# EAGLE design e-Tapperhandpiece30 (EAGLE 8.4.1)
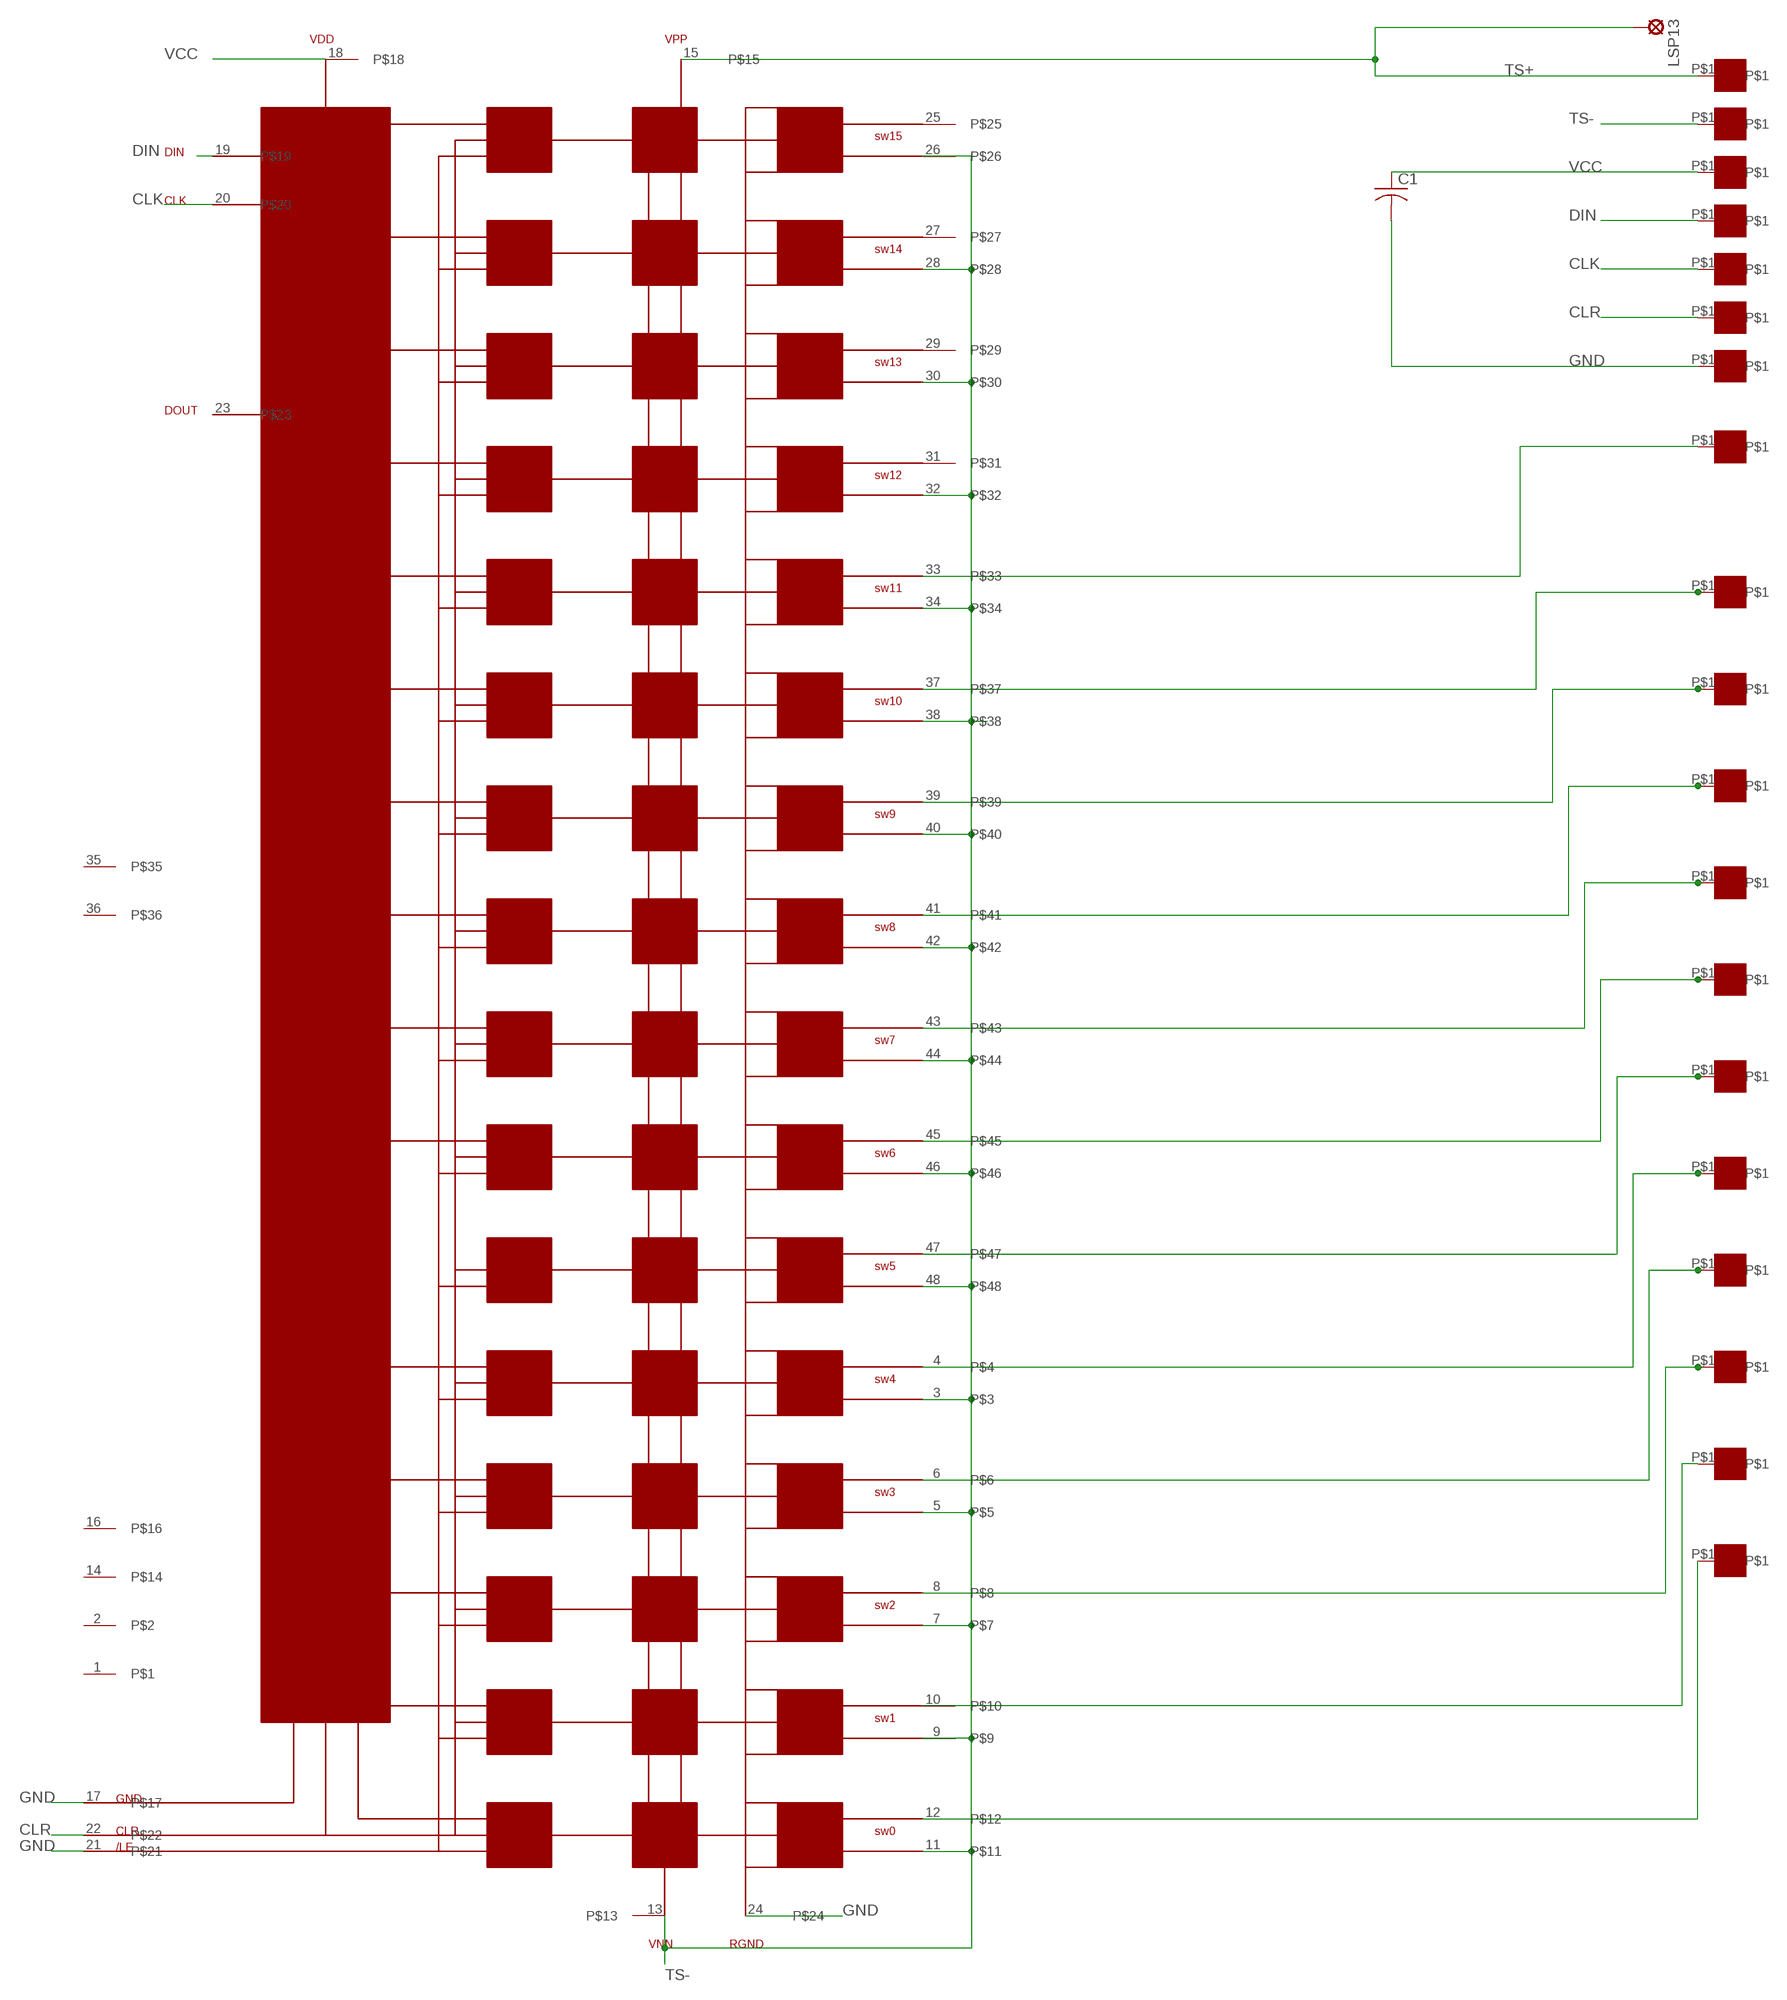
[diagram p0: schematic, sheet 1]

## Parts
C1  C-USC0805  [C0805]
LSP13  SE11  [SE11]
TSP1  ET1  [ET1]
TSP2  ET1  [ET1]
TSP3  ET1  [ET1]
TSP4  ET1  [ET1]
TSP5  ET1  [ET1]
TSP6  ET1  [ET1]
TSP7  ET1  [ET1]
TSP8  ET1  [ET1]
TSP9  ET1  [ET1]
TSP10  ET1  [ET1]
TSP11  ET1  [ET1]
TSP12  ET1  [ET1]
TSP13  ET1  [ET1]
TSP14  ET1  [ET1]
TSP15  ET1  [ET1]
TSP16  ET1  [ET1]
TSP17  ET1  [ET1]
TSP18  ET1  [ET1]
TSP19  ET1  [ET1]
U$1  CPC7701  [LQFP48]

## Nets
CLK: TSP17.P$1 U$1.20
CLR: TSP18.P$1 U$1.22
DIN: TSP16.P$1 U$1.19
GND: C1.2 TSP19.P$1 U$1.17 U$1.21 U$1.24
N$4: TSP1.P$1 U$1.33
N$6: TSP2.P$1 U$1.37
N$10: TSP3.P$1 U$1.39
N$11: TSP4.P$1 U$1.41
N$12: TSP5.P$1 U$1.43
N$13: TSP6.P$1 U$1.45
N$14: TSP7.P$1 U$1.47
N$15: TSP8.P$1 U$1.4
N$16: TSP9.P$1 U$1.6
N$17: TSP10.P$1 U$1.8
N$21: TSP11.P$1 U$1.10
N$26: TSP12.P$1 U$1.12
TS+: LSP13.MP TSP13.P$1 U$1.15
TS-: TSP14.P$1 U$1.3 U$1.5 U$1.7 U$1.9 U$1.11 U$1.13 U$1.26 U$1.28 U$1.30 U$1.32 U$1.34 U$1.38 U$1.40 U$1.42 U$1.44 U$1.46 U$1.48
VCC: C1.1 TSP15.P$1 U$1.18
Unconnected: U$1.1 U$1.2 U$1.14 U$1.16 U$1.23 U$1.25 U$1.27 U$1.29 U$1.31 U$1.35 U$1.36

## Library data of the parts
C1 = resistor:C-US: CAPACITOR, American symbol
LSP13 = solpad:SE11: SOLDER PAD RTM, drill 1,1mm, distributor Buerklin, 07F810
TSP1-TSP19 = ET1:ET1: Through Hold Pads 20 mil drill hole
U$1 = CPC7701:CPC7701: High Voltage cmos 16 channel analog switch in 48 plcc package 3.3V logic level 200V switch

## Net classes
0 default: clearance 0.205 mm

## Board
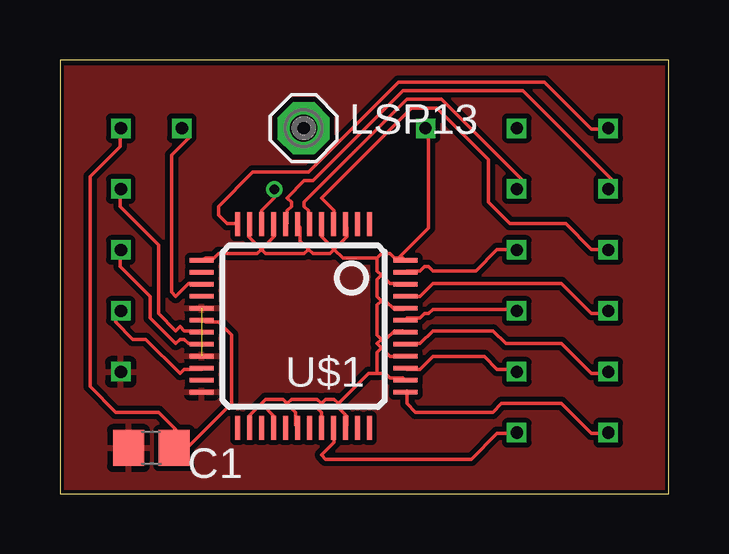
[diagram p1: board, top side]
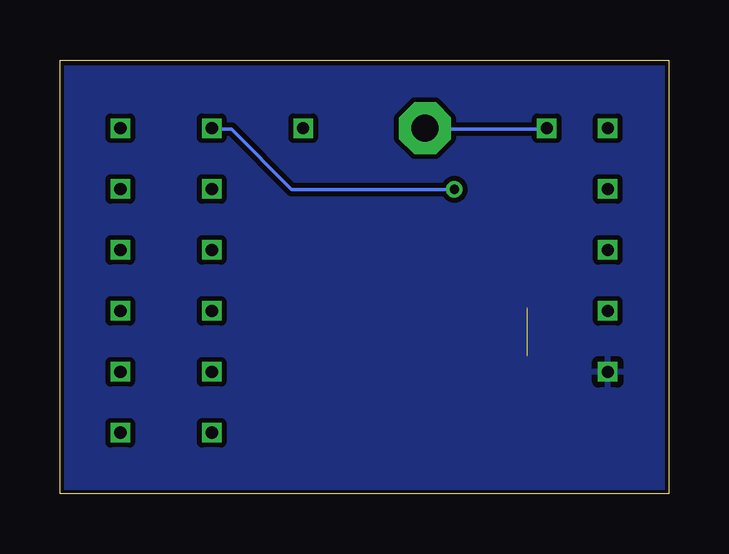
[diagram p2: board, bottom side, seen from below]

Size 25.38 x 18.09 mm. Coordinates in mm from the lower left corner, seen from the top.
Outline: 0,0 25.38,0 25.38,18.09 0,18.09 0,0
Copper layers (1*16): Top 0.035mm / dielectric 1.5mm / Bottom 0.035mm
Design rules "e-tapperhandpiece14 *": minimum track width 6mil, minimum drill 15mil, track to track 6mil, track to pad 6mil, pad to pad 6mil, via to via 6mil, smd to smd 6mil, copper to edge 6mil, drill to drill 6mil, minimum pad ring 6mil, minimum via ring 6mil, stop-mask expansion 4mil, vias tented up to drill 0mil, thermal gap 10mil

### Footprints (pad centres in the part's own frame; a part is rotated, then mirrored left to right if it is on the bottom)
C0805 = smd 1.3 x 1.5: 1 -0.95,0; 2 0.95,0
SE11 = drill 1.118 pad 2.159 octagon: MP 0,0
ET1 = drill 0.508 square: P$1 0,0
LQFP48 = smd 0.2 x 1: 1 -2.75,-4.25; 2 -2.25,-4.25; 3 -1.75,-4.25; 4 -1.25,-4.25; 5 -0.75,-4.25; 6 -0.25,-4.25; 7 0.25,-4.25; 8 0.75,-4.25; 9 1.25,-4.25; 10 1.75,-4.25; 11 2.25,-4.25; 12 2.75,-4.25; 25 2.75,4.25; 26 2.25,4.25; 27 1.75,4.25; 28 1.25,4.25; 29 0.75,4.25; 30 0.25,4.25; 31 -0.25,4.25; 32 -0.75,4.25; 33 -1.25,4.25; 34 -1.75,4.25; 35 -2.25,4.25; 36 -2.75,4.25 | smd 1 x 0.2: 13 4.25,-2.75; 14 4.25,-2.25; 15 4.25,-1.75; 16 4.25,-1.25; 17 4.25,-0.75; 18 4.25,-0.25; 19 4.25,0.25; 20 4.25,0.75; 21 4.25,1.25; 22 4.25,1.75; 23 4.25,2.25; 24 4.25,2.75; 37 -4.25,2.75; 38 -4.25,2.25; 39 -4.25,1.75; 40 -4.25,1.25; 41 -4.25,0.75; 42 -4.25,0.25; 43 -4.25,-0.25; 44 -4.25,-0.75; 45 -4.25,-1.25; 46 -4.25,-1.75; 47 -4.25,-2.25; 48 -4.25,-2.75

### Placement (x,y rotation side)
C1  3.81,1.91 180 top
LSP13  10.16,15.24 0 top
TSP1  19.05,2.54 0 top
TSP2  22.86,2.54 0 top
TSP3  19.05,5.08 0 top
TSP4  22.86,5.08 0 top
TSP5  19.05,7.62 0 top
TSP6  22.86,7.62 0 top
TSP7  19.05,10.16 0 top
TSP8  22.86,10.16 0 top
TSP9  19.05,12.7 0 top
TSP10  22.86,12.7 0 top
TSP11  19.05,15.24 0 top
TSP12  22.86,15.24 0 top
TSP13  5.08,15.24 0 top
TSP14  15.24,15.24 0 top
TSP15  2.54,15.24 180 top
TSP16  2.54,12.7 180 top
TSP17  2.54,10.16 180 top
TSP18  2.54,7.62 270 top
TSP19  2.54,5.08 270 top
U$1  10.16,6.99 180 top

### Tracks (layer width: path | path; a pad name or v marks a point on that pad's centre or on a via)
CLK
  Top 0.152: U$1.20 5.9,6.25 5.36,6.25 5.18,6.43 5,6.43 4.83,6.25 3.75,7.33 3.75,8.22 2.5,9.47 2.5,10.01 TSP17.P$1
CLR
  Top 0.152: U$1.22 5.9,5.18 5.18,5.18 5,5 3.57,6.43 3.04,6.43 2.32,7.15 2.32,7.33 2.5,7.5 TSP18.P$1
DIN
  Top 0.152: U$1.19 5.9,6.79 5.18,6.79 5,6.97 4.83,6.79 4.11,7.5 4.11,10.37 2.5,11.97 2.5,12.69 TSP16.P$1
GND  (1 unrouted)
  pour Top: 0,0 0,17.78 25.4,17.78 25.4,0
  pour Bottom: 0,0 0,17.78 25.4,17.78 25.4,0
N$4
  Top 0.152: U$1.33 11.44,2.68 11.44,2.14 10.9,1.61 11.08,1.43 17.16,1.43 18.23,2.5 18.94,2.5 TSP1.P$1
N$6
  Top 0.152: U$1.37 14.47,4.29 14.47,3.75 14.83,3.4 18.05,3.4 18.41,3.75 20.91,3.75 22.16,2.5 22.7,2.5 TSP2.P$1
N$10
  Top 0.152: U$1.39 14.47,5.18 15.01,5.18 15.55,5.72 17.69,5.72 18.23,5.18 18.94,5.18 TSP3.P$1
N$11
  Top 0.152: U$1.41 14.47,6.25 15.01,6.25 15.55,6.79 18.05,6.79 18.59,6.25 20.91,6.25 22.16,5 22.7,5 TSP4.P$1
N$12
  Top 0.152: U$1.43 14.47,7.33 15.01,7.33 15.19,7.5 15.37,7.5 15.55,7.68 18.94,7.68 TSP5.P$1
N$13
  Top 0.152: U$1.45 14.47,8.22 15.01,8.22 15.55,8.76 20.91,8.76 22.16,7.5 22.7,7.5 TSP6.P$1
N$14
  Top 0.152: U$1.47 14.47,9.29 15.01,9.29 15.19,9.47 15.37,9.47 15.55,9.29 17.33,9.29 18.23,10.19 18.94,10.19 TSP7.P$1
N$15
  Top 0.152: U$1.4 11.44,11.26 11.44,11.79 10.9,12.33 14.65,16.08 15.73,16.08 17.87,13.94 17.87,12.15 18.76,11.26 21.09,11.26 22.16,10.19 22.7,10.19 TSP8.P$1
N$16
  Top 0.152: U$1.6 10.37,11.26 10.37,11.79 10.19,11.97 10.19,12.15 14.47,16.44 15.9,16.44 19.3,13.04 19.3,12.87 19.12,12.69 TSP9.P$1
N$17
  Top 0.152: U$1.8 9.47,11.26 9.47,11.79 9.65,11.97 9.65,12.15 9.47,12.33 10.19,13.04 10.54,13.04 14.3,16.8 19.3,16.8 23.05,13.04 23.05,12.87 22.87,12.69 TSP10.P$1
N$21  (via drill 0.38)
  Top 0.152: v8.94,12.69 8.94,12.33 8.4,11.79 8.4,11.26 U$1.10
  Bottom 0.152: v8.94,12.69 15.73,12.69 18.23,15.19 18.94,15.19 TSP11.P$1
N$26
  Top 0.152: U$1.12 7.33,11.26 6.97,11.26 6.61,11.62 6.61,11.97 8.04,13.4 10.37,13.4 14.12,17.16 20.19,17.16 22.16,15.19 22.7,15.19 TSP12.P$1
TS+
  Top 0.152: U$1.15 5.9,8.76 5.36,8.76 4.83,8.22 4.65,8.4 4.65,14.12 5.36,14.83 5.36,15.01 5.18,15.19 TSP13.P$1
  Bottom 0.152: TSP13.P$1 5.18,15.19 10.01,15.19 LSP13.MP
TS-
  Top 0.152: 8.4,10.19 8.94,10.72 8.94,11.08 U$1.9 | 8.4,10.19 8.22,10.01 6.61,10.01 6.43,9.83 6.08,9.83 U$1.13 | 8.4,10.19 7.86,10.72 7.86,11.08 U$1.11 | 10.37,10.19 10.01,10.54 10.01,11.08 U$1.7 | 10.37,10.19 10.19,10.01 8.58,10.01 8.4,10.19 | 11.44,10.19 10.9,10.72 10.9,11.08 U$1.5 | 11.44,10.19 11.26,10.01 10.54,10.01 10.37,10.19 | 11.44,10.19 11.97,10.72 11.97,11.08 U$1.3 | 8.4,3.75 7.86,3.22 7.86,2.86 U$1.26 | 8.4,3.75 8.94,3.22 8.94,2.86 U$1.28 | 9.47,3.75 9.29,3.93 8.58,3.93 8.4,3.75 | 9.47,3.75 9.83,3.4 9.83,2.86 U$1.30 | 10.9,3.75 10.72,3.57 10.9,3.4 10.9,2.86 U$1.32 | 10.9,3.75 10.72,3.93 9.65,3.93 9.47,3.75 | 11.62,3.75 11.62,3.57 11.97,3.22 11.97,2.86 U$1.34 | 11.62,3.75 11.44,3.93 11.08,3.93 10.9,3.75 | 13.22,5 12.87,5 11.62,3.75 | 13.22,5 13.58,5 13.76,4.83 14.3,4.83 U$1.38 | 13.4,6.08 13.76,5.72 14.3,5.72 U$1.40 | 13.4,6.08 13.22,5.9 13.22,5 | 13.4,6.43 13.58,6.43 13.94,6.79 14.3,6.79 U$1.42 | 13.4,6.43 13.22,6.25 13.4,6.08 | 13.4,8.04 13.58,8.04 13.94,7.68 14.3,7.68 U$1.44 | 13.4,8.04 13.22,7.86 13.22,6.61 13.4,6.43 | 13.4,9.11 13.76,8.76 14.3,8.76 U$1.46 | 13.4,9.11 13.22,8.94 13.22,8.22 13.4,8.04 | 14.12,9.83 13.94,9.83 13.76,10.01 13.4,10.01 13.22,9.83 | 14.12,9.83 14.3,9.83 U$1.48 14.12,9.83 | 13.22,9.83 13.22,9.29 13.4,9.11 | 14.12,9.83 15.37,11.08 15.37,15.19 TSP14.P$1 | 11.44,10.19 11.79,9.83 13.22,9.83
VCC
  Top 0.152: 4.83,1.97 5.36,1.97 7.15,3.75 7.15,6.61 6.61,7.15 6.08,7.15 U$1.18 | 4.83,1.97 4.83,2.68 4.11,3.4 2.32,3.4 1.25,4.47 1.25,13.22 2.5,14.47 2.5,15.19 TSP15.P$1 | 4.83,1.97 C1.1